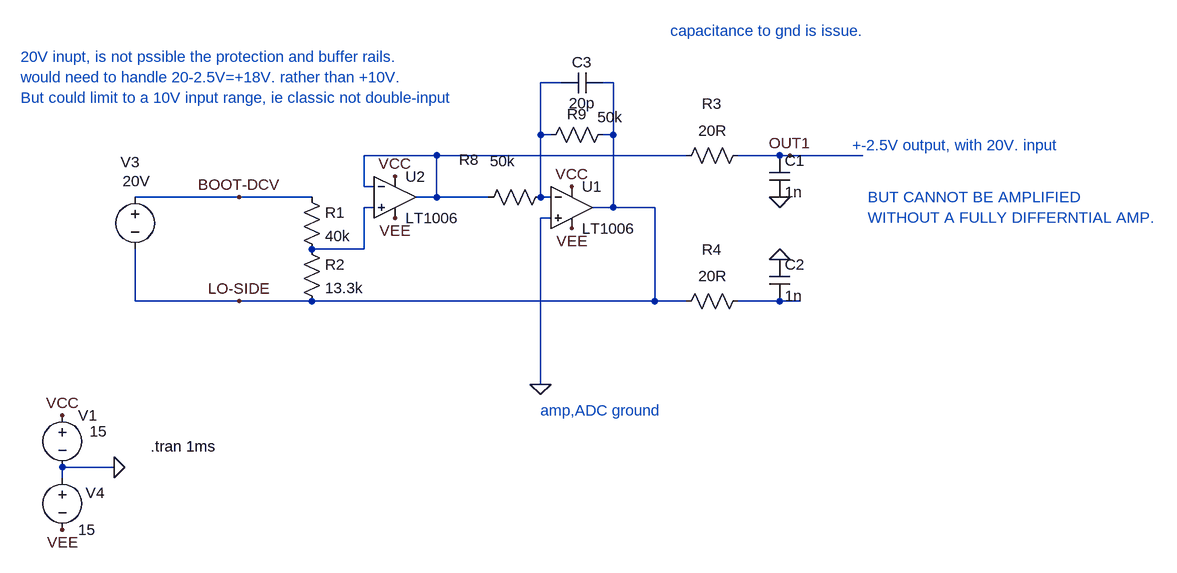
[diagram p0: schematic Draft08.asc]
Draft08.asc, the LTspice schematic file:
Version 4
SHEET 1 2756 2104
WIRE -96 -736 -128 -736
WIRE -16 -736 -32 -736
WIRE -128 -656 -128 -736
WIRE -112 -656 -128 -656
WIRE -16 -656 -16 -736
WIRE -16 -656 -32 -656
WIRE -288 -624 -400 -624
WIRE 96 -624 -288 -624
WIRE 240 -624 176 -624
WIRE 256 -624 240 -624
WIRE 368 -624 256 -624
WIRE -400 -576 -400 -624
WIRE -384 -576 -400 -576
WIRE -592 -560 -752 -560
WIRE -480 -560 -592 -560
WIRE -288 -560 -288 -624
WIRE -288 -560 -320 -560
WIRE -208 -560 -288 -560
WIRE -128 -560 -128 -656
WIRE -112 -560 -128 -560
WIRE -384 -544 -400 -544
WIRE -16 -544 -16 -656
WIRE -16 -544 -48 -544
WIRE 48 -544 -16 -544
WIRE -112 -528 -128 -528
WIRE -400 -480 -400 -544
WIRE -400 -480 -480 -480
WIRE -752 -400 -752 -480
WIRE -592 -400 -752 -400
WIRE -480 -400 -592 -400
WIRE 48 -400 48 -544
WIRE 48 -400 -480 -400
WIRE 96 -400 48 -400
WIRE 240 -400 176 -400
WIRE 272 -400 240 -400
WIRE -128 -272 -128 -528
WIRE -784 -144 -864 -144
WIRE -864 -128 -864 -144
FLAG -864 -224 VCC
FLAG -864 -48 VEE
FLAG -784 -144 0
FLAG -80 -576 VCC
FLAG -80 -512 VEE
FLAG -128 -272 0
FLAG -592 -400 LO-SIDE
FLAG -592 -560 BOOT-DCV
FLAG -352 -592 VCC
FLAG -352 -528 VEE
FLAG 256 -624 OUT1
FLAG 240 -560 0
FLAG 240 -464 0
SYMBOL voltage -864 -240 R0
WINDOW 123 0 0 Left 0
WINDOW 39 0 0 Left 0
WINDOW 3 42 41 Left 2
SYMATTR Value 15
SYMATTR InstName V1
SYMBOL voltage -864 -144 R0
WINDOW 123 0 0 Left 0
WINDOW 39 0 0 Left 0
WINDOW 0 36 39 Left 2
SYMATTR InstName V4
SYMATTR Value 15
SYMBOL OpAmps\\LT1006 -80 -608 R0
SYMATTR InstName U1
SYMBOL voltage -752 -576 R0
WINDOW 123 0 0 Left 0
WINDOW 39 0 0 Left 0
WINDOW 3 -19 -9 Left 2
WINDOW 0 -22 -38 Left 2
SYMATTR Value 20V
SYMATTR InstName V3
SYMBOL res -224 -544 R270
WINDOW 0 58 -14 VTop 2
WINDOW 3 87 38 VBottom 2
SYMATTR InstName R8
SYMATTR Value 50k
SYMBOL res -128 -640 R270
WINDOW 0 32 56 VTop 2
WINDOW 3 59 107 VBottom 2
SYMATTR InstName R9
SYMATTR Value 50k
SYMBOL OpAmps\\LT1006 -352 -624 R0
SYMATTR InstName U2
SYMBOL res -496 -576 R0
SYMATTR InstName R1
SYMATTR Value 40k
SYMBOL res -496 -496 R0
SYMATTR InstName R2
SYMATTR Value 13.3k
SYMBOL cap 224 -624 R0
SYMATTR InstName C1
SYMATTR Value 1n
SYMBOL cap 224 -464 R0
SYMATTR InstName C2
SYMATTR Value 1n
SYMBOL res 80 -608 R270
WINDOW 0 80 56 VTop 2
WINDOW 3 70 57 VBottom 2
SYMATTR InstName R3
SYMATTR Value 20R
SYMBOL res 80 -384 R270
WINDOW 0 80 56 VTop 2
WINDOW 3 70 57 VBottom 2
SYMATTR InstName R4
SYMATTR Value 20R
SYMBOL cap -32 -752 R90
WINDOW 0 0 32 VBottom 2
WINDOW 3 32 32 VTop 2
SYMATTR InstName C3
SYMATTR Value 20p
TEXT -728 -176 Left 2 !.tran 1ms
TEXT -128 -232 Left 2 ;amp,ADC ground
TEXT 352 -640 Left 2 ;+-2.5V output, with 20V. input
TEXT -928 -776 Left 2 ;20V inupt, is not pssible the protection and buffer rails.\nwould need to handle 20-2.5V=+18V. rather than +10V.\nBut could limit to a 10V input range, ie classic not double-input
TEXT 72 -816 Left 2 ;capacitance to gnd is issue.
TEXT 376 -560 Left 2 ;BUT CANNOT BE AMPLIFIED\nWITHOUT A FULLY DIFFERNTIAL AMP.

The netlist it stands for:
* Draft08.asc
V1 VCC 0 15
V4 0 VEE 15
XU1 0 N001 VCC VEE LO-SIDE LT1006  ; pins In+ In- V+ V- OUT
V3 BOOT-DCV LO-SIDE 20V
R8 N002 N001 50k
R9 N001 LO-SIDE 50k
XU2 N003 N002 VCC VEE N002 LT1006  ; pins In+ In- V+ V- OUT
R1 BOOT-DCV N003 40k
R2 N003 LO-SIDE 13.3k
C1 OUT1 0 1n
C2 0 N004 1n
R3 N002 OUT1 20R
R4 LO-SIDE N004 20R
C3 LO-SIDE N001 20p
.tran 1ms
* amp,ADC ground
* +-2.5V output, with 20V. input
* 20V inupt, is not pssible the protection and buffer rails.
* would need to handle 20-2.5V=+18V. rather than +10V.
* But could limit to a 10V input range, ie classic not double-input
* capacitance to gnd is issue.
* BUT CANNOT BE AMPLIFIED
* WITHOUT A FULLY DIFFERNTIAL AMP.
.lib LTC.lib
.backanno
.end